# EAGLE schematic 1 Strain Gauge Board (EAGLE 9.1.3)
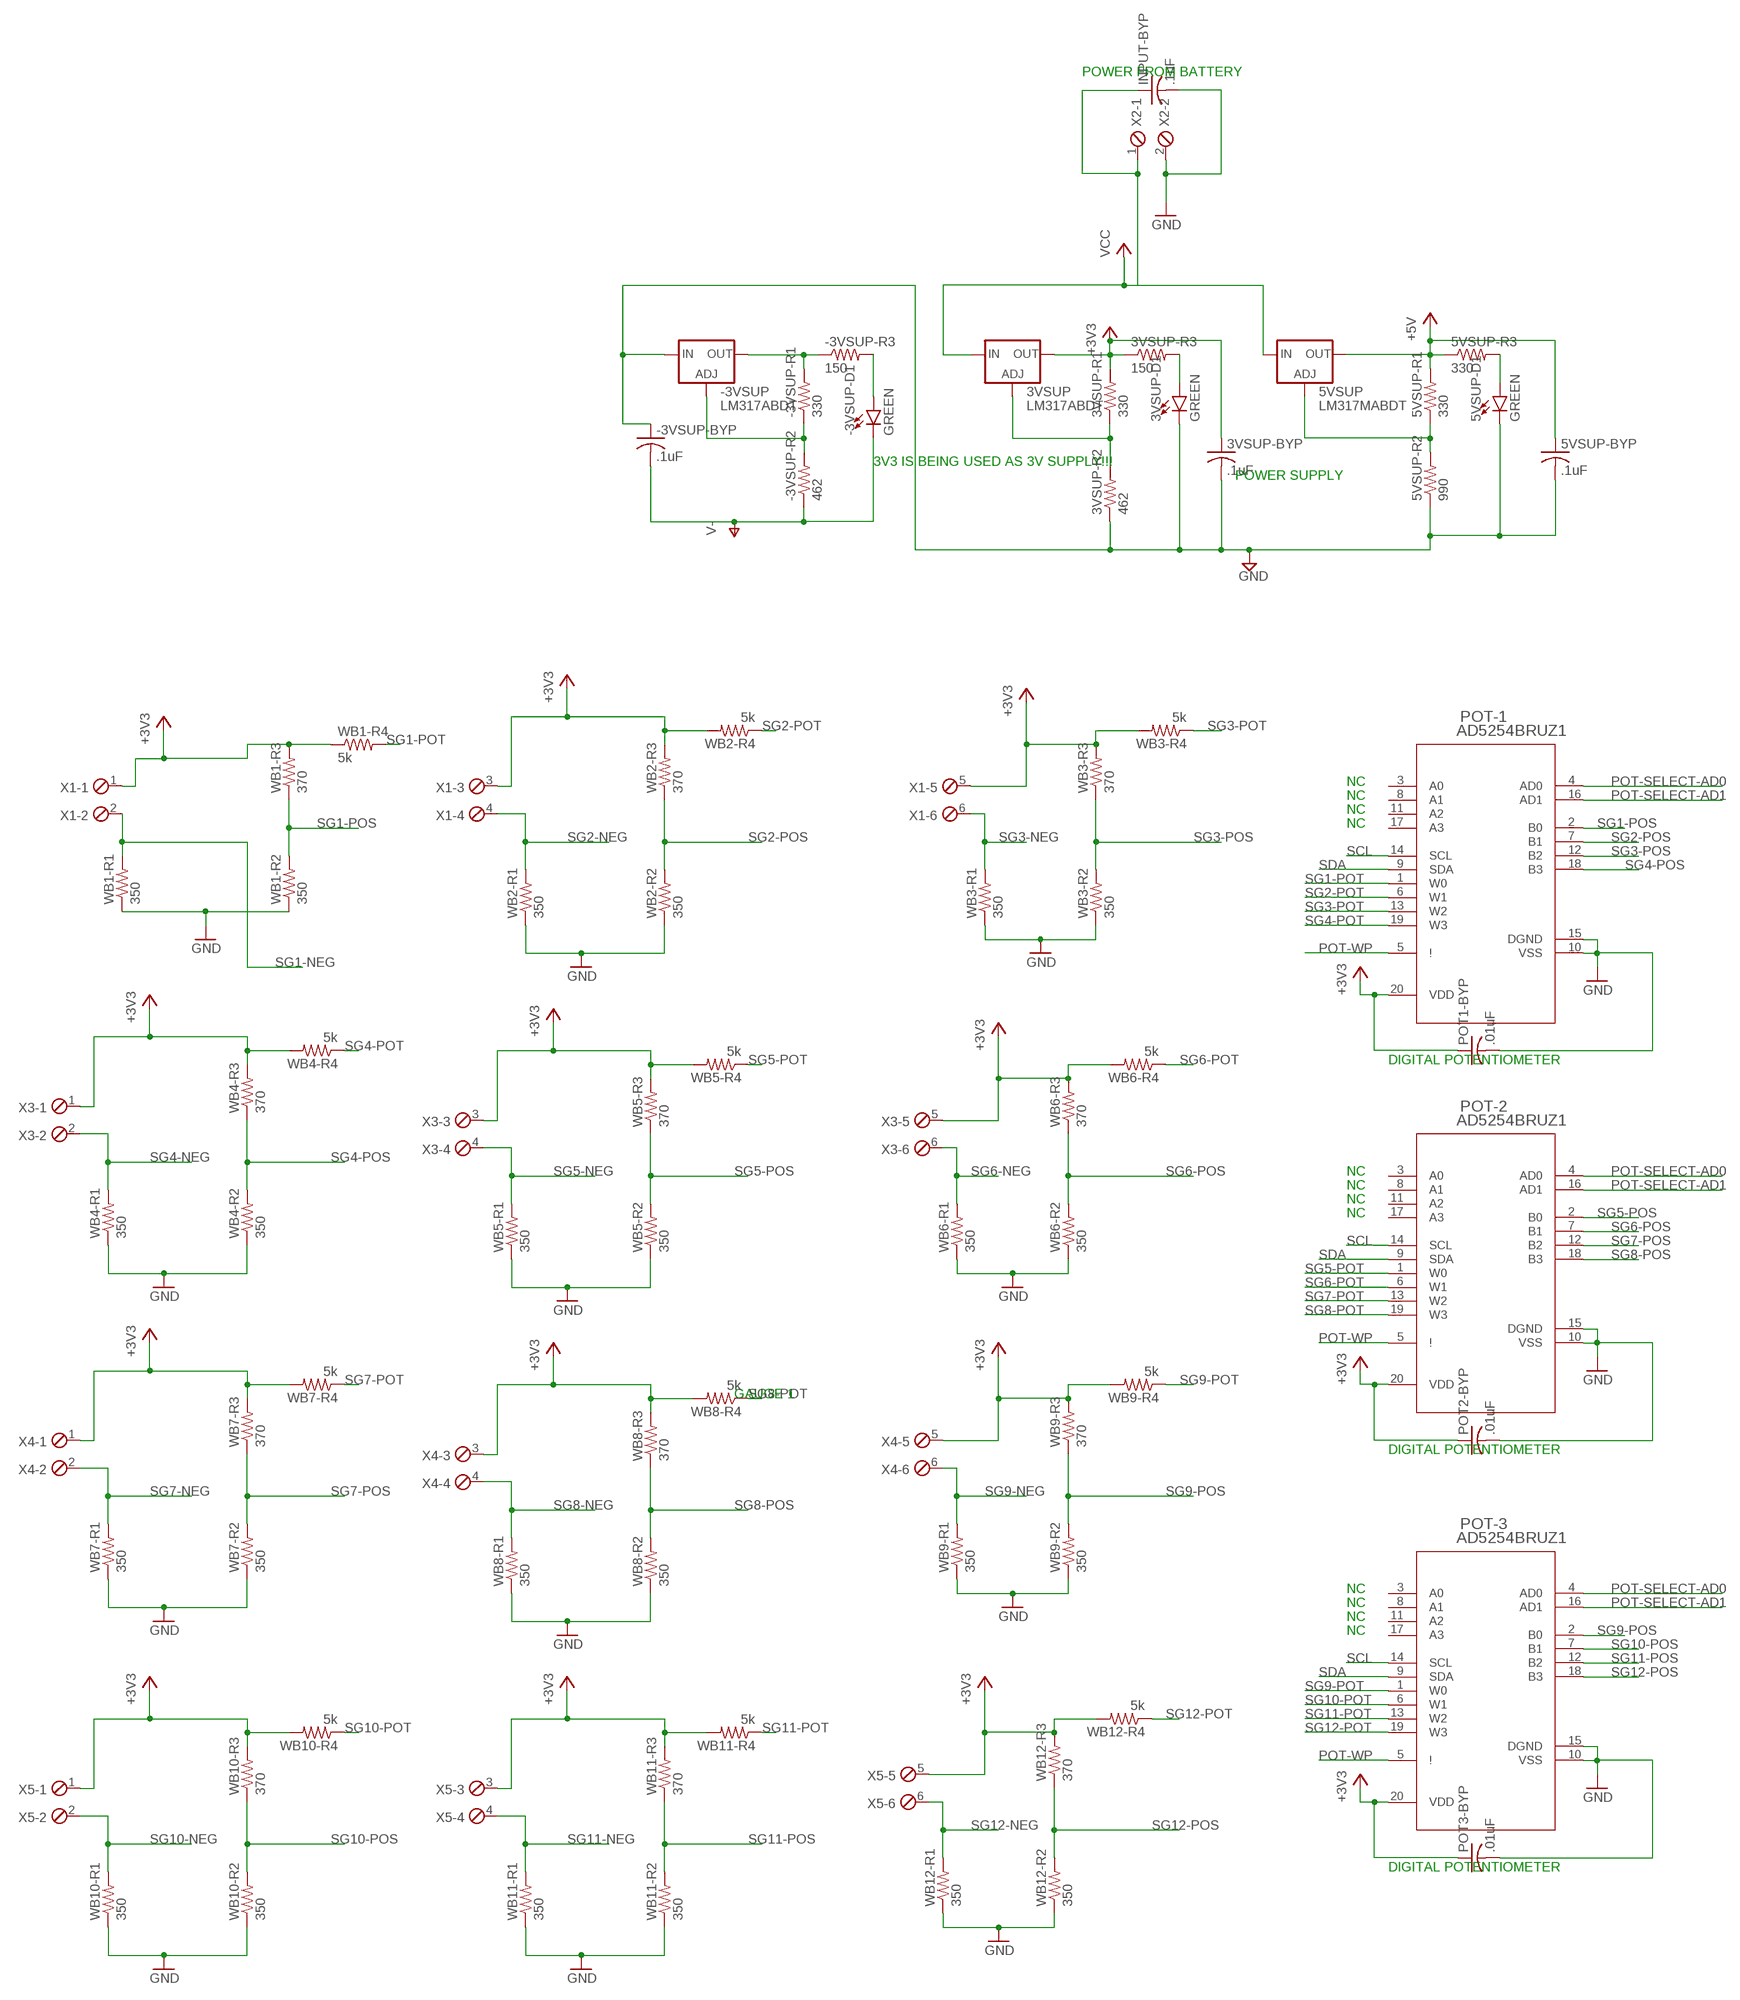
[diagram p0: schematic, sheet 1, part 1 of 3]
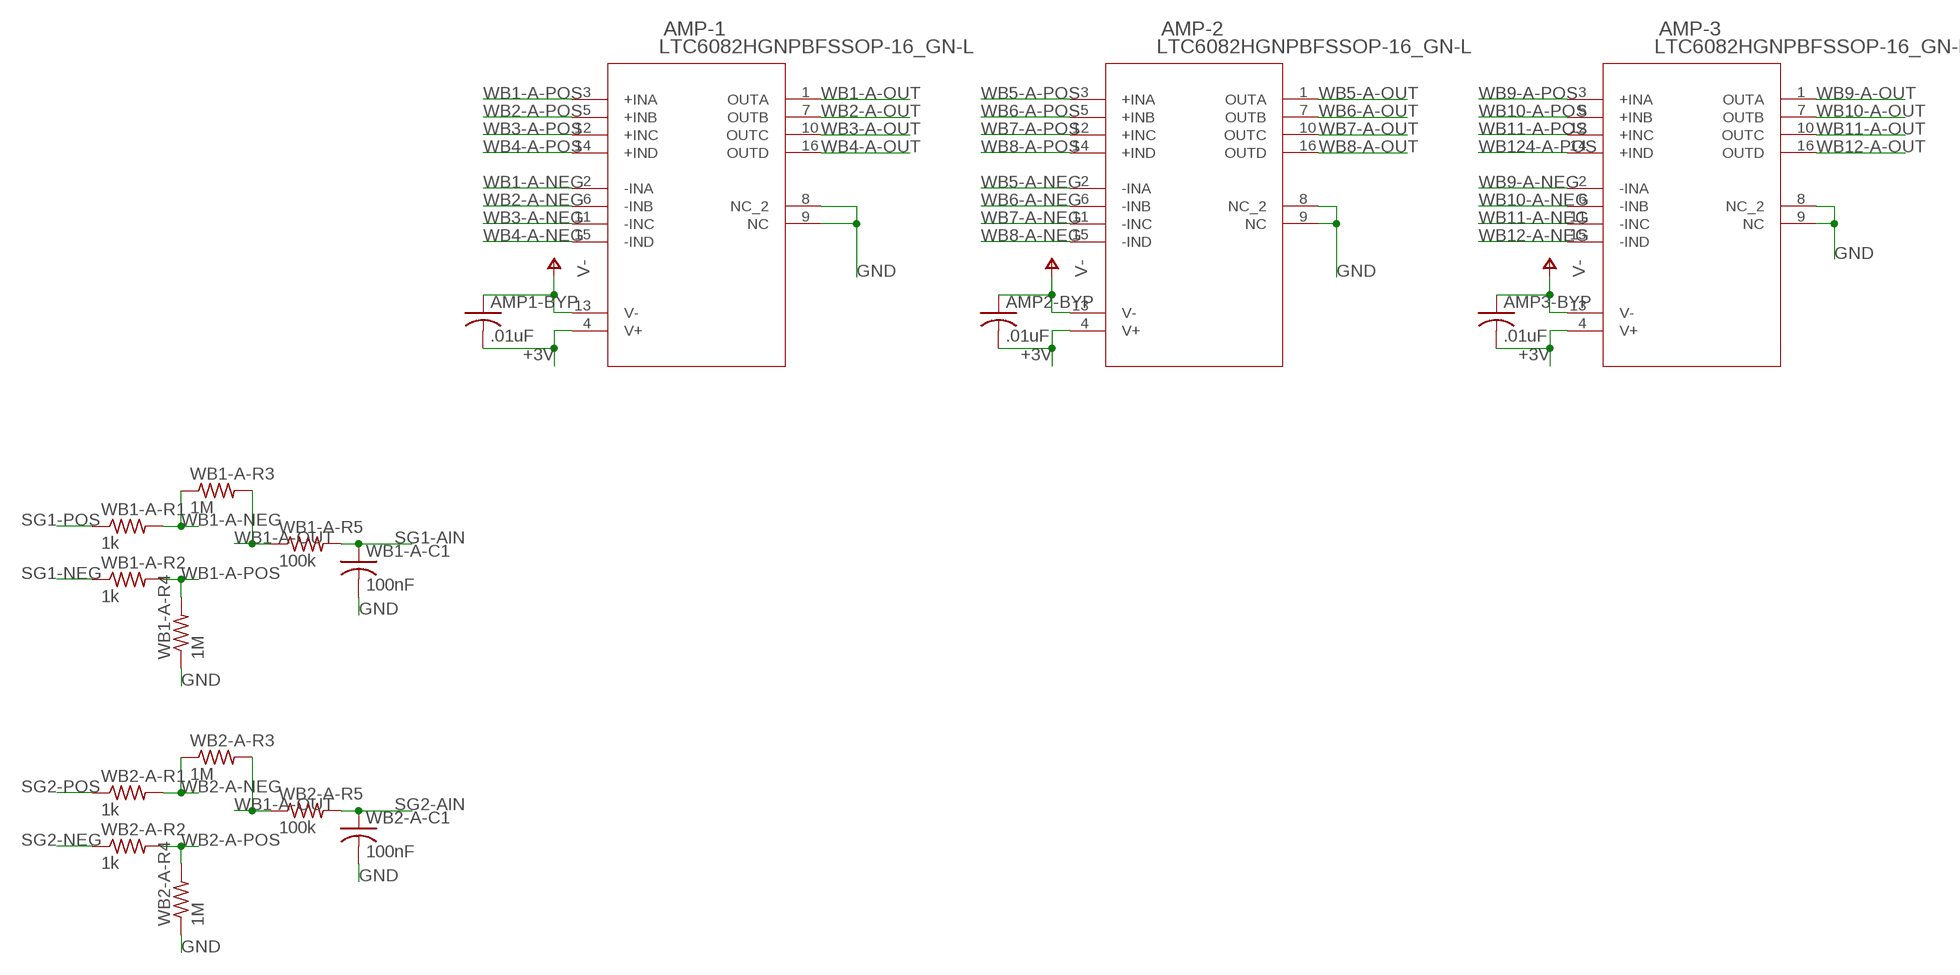
[diagram p1: schematic, sheet 1, part 2 of 3]
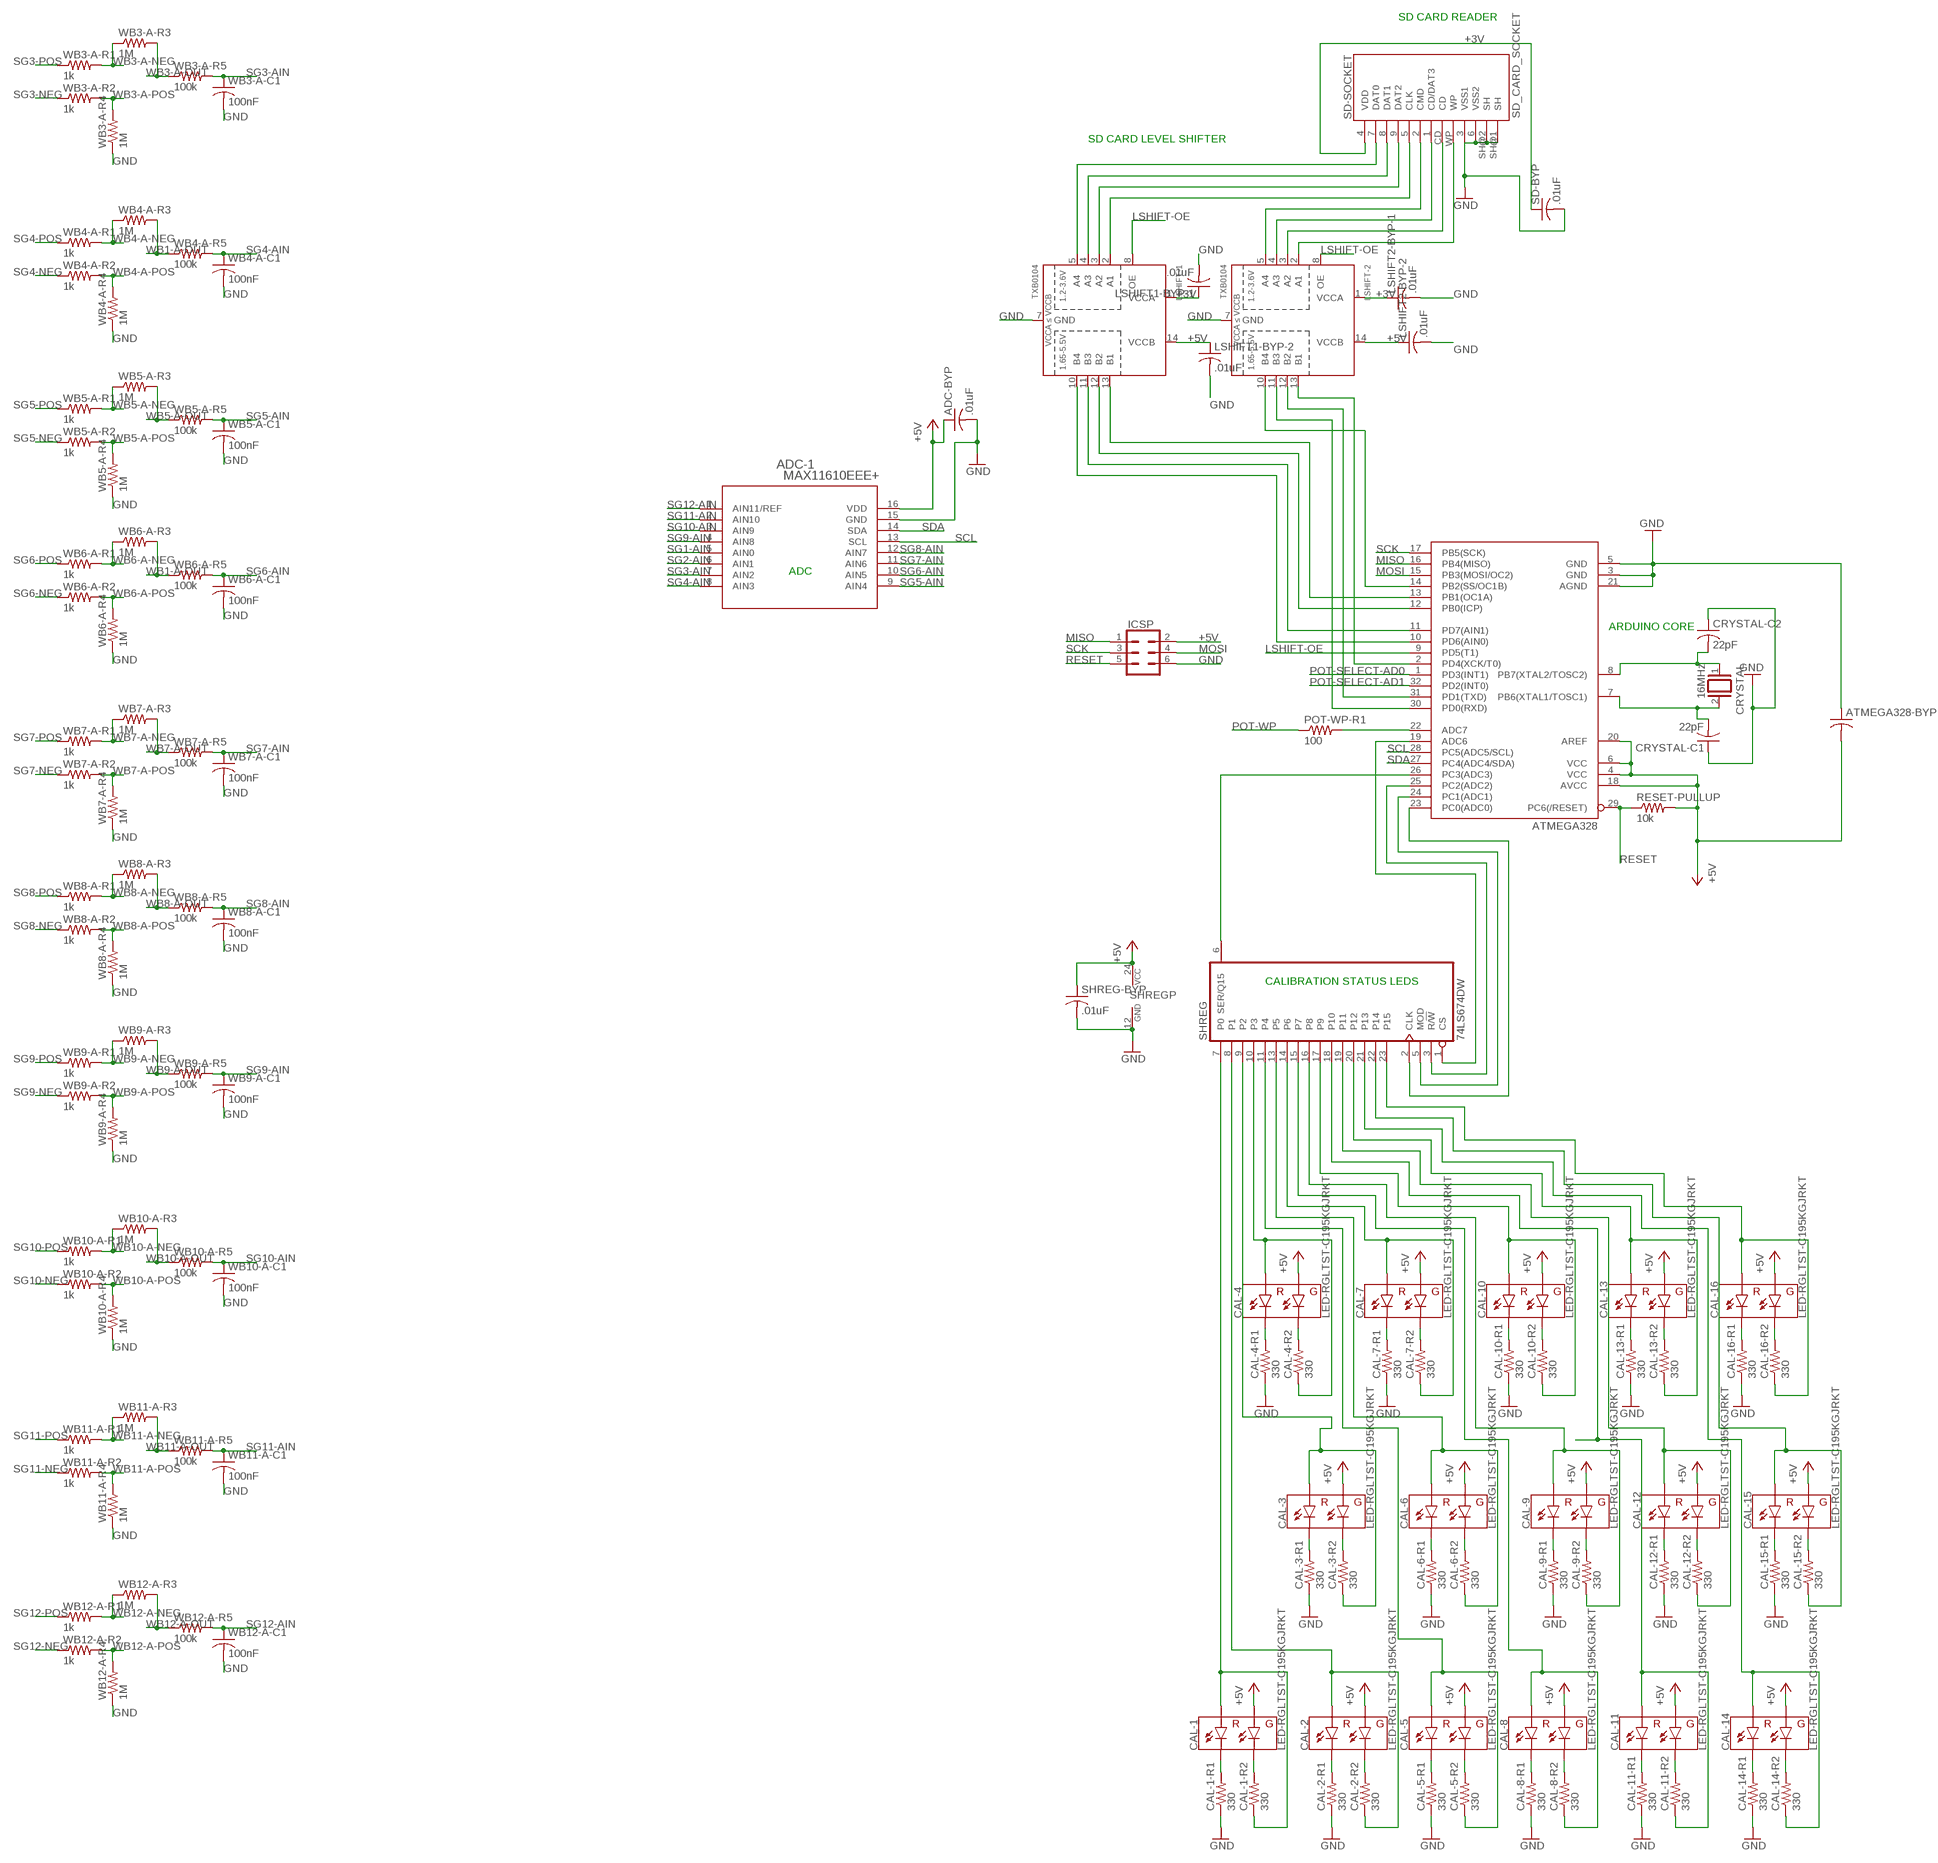
[diagram p2: schematic, sheet 1, part 3 of 3]

## Parts
3VSUP  LM317ABDT  LM317MABDT  [DPACK]
3VSUP-BYP  .1uF  C-USC1206K  [C1206K]
3VSUP-D1  GREEN  LED-GREEN1206  [LED-1206]
3VSUP-R1  330  R-US_M1206  [M1206]
3VSUP-R2  462  R-US_M1206  [M1206]
3VSUP-R3  150  R-US_M1206  [M1206]
5VSUP  LM317MABDT  [DPACK]
5VSUP-BYP  .1uF  C-USC1206K  [C1206K]
5VSUP-D1  GREEN  LED-GREEN1206  [LED-1206]
5VSUP-R1  330  R-US_M1206  [M1206]
5VSUP-R2  990  R-US_M1206  [M1206]
5VSUP-R3  330  R-US_M1206  [M1206]
-3VSUP  LM317ABDT  LM317MABDT  [DPACK]
-3VSUP-BYP  .1uF  C-USC1206K  [C1206K]
-3VSUP-D1  GREEN  LED-GREEN1206  [LED-1206]
-3VSUP-R1  330  R-US_M1206  [M1206]
-3VSUP-R2  462  R-US_M1206  [M1206]
-3VSUP-R3  150  R-US_M1206  [M1206]
ADC-1  MAX11610EEE+  [21-0055H_16]
ADC-BYP  .01uF  C-USC1206K  [C1206K]
AMP1-BYP  .01uF  C-USC1206K  [C1206K]
AMP2-BYP  .01uF  C-USC1206K  [C1206K]
AMP3-BYP  .01uF  C-USC1206K  [C1206K]
AMP-1  LTC6082HGNPBFSSOP-16_GN-L  [SSOP-16_GN-L]
AMP-2  LTC6082HGNPBFSSOP-16_GN-L  [SSOP-16_GN-L]
AMP-3  LTC6082HGNPBFSSOP-16_GN-L  [SSOP-16_GN-L]
ATMEGA328  ATMEGA328P_TQFP  [TQFP32-08]
ATMEGA328-BYP  C-USC1206  [C1206]
CAL-1  LED-RGLTST-C195KGJRKT  [LTST-C195KGJRKT]
CAL-1-R1  330  R-US_M1206  [M1206]
CAL-1-R2  330  R-US_M1206  [M1206]
CAL-2  LED-RGLTST-C195KGJRKT  [LTST-C195KGJRKT]
CAL-2-R1  330  R-US_M1206  [M1206]
CAL-2-R2  330  R-US_M1206  [M1206]
CAL-3  LED-RGLTST-C195KGJRKT  [LTST-C195KGJRKT]
CAL-3-R1  330  R-US_M1206  [M1206]
CAL-3-R2  330  R-US_M1206  [M1206]
CAL-4  LED-RGLTST-C195KGJRKT  [LTST-C195KGJRKT]
CAL-4-R1  330  R-US_M1206  [M1206]
CAL-4-R2  330  R-US_M1206  [M1206]
CAL-5  LED-RGLTST-C195KGJRKT  [LTST-C195KGJRKT]
CAL-5-R1  330  R-US_M1206  [M1206]
CAL-5-R2  330  R-US_M1206  [M1206]
CAL-6  LED-RGLTST-C195KGJRKT  [LTST-C195KGJRKT]
CAL-6-R1  330  R-US_M1206  [M1206]
CAL-6-R2  330  R-US_M1206  [M1206]
CAL-7  LED-RGLTST-C195KGJRKT  [LTST-C195KGJRKT]
CAL-7-R1  330  R-US_M1206  [M1206]
CAL-7-R2  330  R-US_M1206  [M1206]
CAL-8  LED-RGLTST-C195KGJRKT  [LTST-C195KGJRKT]
CAL-8-R1  330  R-US_M1206  [M1206]
CAL-8-R2  330  R-US_M1206  [M1206]
CAL-9  LED-RGLTST-C195KGJRKT  [LTST-C195KGJRKT]
CAL-9-R1  330  R-US_M1206  [M1206]
CAL-9-R2  330  R-US_M1206  [M1206]
CAL-10  LED-RGLTST-C195KGJRKT  [LTST-C195KGJRKT]
CAL-10-R1  330  R-US_M1206  [M1206]
CAL-10-R2  330  R-US_M1206  [M1206]
CAL-11  LED-RGLTST-C195KGJRKT  [LTST-C195KGJRKT]
CAL-11-R1  330  R-US_M1206  [M1206]
CAL-11-R2  330  R-US_M1206  [M1206]
CAL-12  LED-RGLTST-C195KGJRKT  [LTST-C195KGJRKT]
CAL-12-R1  330  R-US_M1206  [M1206]
CAL-12-R2  330  R-US_M1206  [M1206]
CAL-13  LED-RGLTST-C195KGJRKT  [LTST-C195KGJRKT]
CAL-13-R1  330  R-US_M1206  [M1206]
CAL-13-R2  330  R-US_M1206  [M1206]
CAL-14  LED-RGLTST-C195KGJRKT  [LTST-C195KGJRKT]
CAL-14-R1  330  R-US_M1206  [M1206]
CAL-14-R2  330  R-US_M1206  [M1206]
CAL-15  LED-RGLTST-C195KGJRKT  [LTST-C195KGJRKT]
CAL-15-R1  330  R-US_M1206  [M1206]
CAL-15-R2  330  R-US_M1206  [M1206]
CAL-16  LED-RGLTST-C195KGJRKT  [LTST-C195KGJRKT]
CAL-16-R1  330  R-US_M1206  [M1206]
CAL-16-R2  330  R-US_M1206  [M1206]
CRYSTAL  16MHz  XTAL/S  [QS]
CRYSTAL-C1  22pF  C-USC1206K  [C1206K]
CRYSTAL-C2  22pF  C-USC1206K  [C1206K]
ICSP  CONN_03X2FEMALE  [2X3]
INPUT-BYP  .1uF  C-USC1206K  [C1206K]
LSHIFT1-BYP-1  .01uF  C-USC1206K  [C1206K]
LSHIFT1-BYP-2  .01uF  C-USC1206K  [C1206K]
LSHIFT2-BYP-1  .01uF  C-USC1206K  [C1206K]
LSHIFT2-BYP-2  .01uF  C-USC1206K  [C1206K]
LSHIFT-1  TXB0104  TXB0104PWRSOIC14  [SO14]
LSHIFT-2  TXB0104  TXB0104PWRSOIC14  [SO14]
POT1-BYP  .01uF  C-USC1206K  [C1206K]
POT2-BYP  .01uF  C-USC1206K  [C1206K]
POT3-BYP  .01uF  C-USC1206K  [C1206K]
POT-1  AD5254BRUZ1  [RU_20]
POT-2  AD5254BRUZ1  [RU_20]
POT-3  AD5254BRUZ1  [RU_20]
POT-WP-R1  100  R-US_M1206  [M1206]
RESET-PULLUP  10k  R-US_M1206  [M1206]
SD-BYP  .01uF  C-USC1206K  [C1206K]
SD-SOCKET  SD_CARD_SOCKET  [SD]
SHREG  74LS674DW  [SO24W]
SHREG-BYP  .01uF  C-USC1206K  [C1206K]
WB1-A-C1  100nF  C-USC1206K  [C1206K]
WB1-A-R1  1k  R-US_M1206  [M1206]
WB1-A-R2  1k  R-US_M1206  [M1206]
WB1-A-R3  1M  R-US_M1206  [M1206]
WB1-A-R4  1M  R-US_M1206  [M1206]
WB1-A-R5  100k  R-US_M1206  [M1206]
WB1-R1  350  R-US_M1206  [M1206]
WB1-R2  350  R-US_M1206  [M1206]
WB1-R3  370  R-US_M1206  [M1206]
WB1-R4  5k  R-US_M1206  [M1206]
WB2-A-C1  100nF  C-USC1206K  [C1206K]
WB2-A-R1  1k  R-US_M1206  [M1206]
WB2-A-R2  1k  R-US_M1206  [M1206]
WB2-A-R3  1M  R-US_M1206  [M1206]
WB2-A-R4  1M  R-US_M1206  [M1206]
WB2-A-R5  100k  R-US_M1206  [M1206]
WB2-R1  350  R-US_M1206  [M1206]
WB2-R2  350  R-US_M1206  [M1206]
WB2-R3  370  R-US_M1206  [M1206]
WB2-R4  5k  R-US_M1206  [M1206]
WB3-A-C1  100nF  C-USC1206K  [C1206K]
WB3-A-R1  1k  R-US_M1206  [M1206]
WB3-A-R2  1k  R-US_M1206  [M1206]
WB3-A-R3  1M  R-US_M1206  [M1206]
WB3-A-R4  1M  R-US_M1206  [M1206]
WB3-A-R5  100k  R-US_M1206  [M1206]
WB3-R1  350  R-US_M1206  [M1206]
WB3-R2  350  R-US_M1206  [M1206]
WB3-R3  370  R-US_M1206  [M1206]
WB3-R4  5k  R-US_M1206  [M1206]
WB4-A-C1  100nF  C-USC1206K  [C1206K]
WB4-A-R1  1k  R-US_M1206  [M1206]
WB4-A-R2  1k  R-US_M1206  [M1206]
WB4-A-R3  1M  R-US_M1206  [M1206]
WB4-A-R4  1M  R-US_M1206  [M1206]
WB4-A-R5  100k  R-US_M1206  [M1206]
WB4-R1  350  R-US_M1206  [M1206]
WB4-R2  350  R-US_M1206  [M1206]
WB4-R3  370  R-US_M1206  [M1206]
WB4-R4  5k  R-US_M1206  [M1206]
WB5-A-C1  100nF  C-USC1206K  [C1206K]
WB5-A-R1  1k  R-US_M1206  [M1206]
WB5-A-R2  1k  R-US_M1206  [M1206]
WB5-A-R3  1M  R-US_M1206  [M1206]
WB5-A-R4  1M  R-US_M1206  [M1206]
WB5-A-R5  100k  R-US_M1206  [M1206]
WB5-R1  350  R-US_M1206  [M1206]
WB5-R2  350  R-US_M1206  [M1206]
WB5-R3  370  R-US_M1206  [M1206]
WB5-R4  5k  R-US_M1206  [M1206]
WB6-A-C1  100nF  C-USC1206K  [C1206K]
WB6-A-R1  1k  R-US_M1206  [M1206]
WB6-A-R2  1k  R-US_M1206  [M1206]
WB6-A-R3  1M  R-US_M1206  [M1206]
WB6-A-R4  1M  R-US_M1206  [M1206]
WB6-A-R5  100k  R-US_M1206  [M1206]
WB6-R1  350  R-US_M1206  [M1206]
WB6-R2  350  R-US_M1206  [M1206]
WB6-R3  370  R-US_M1206  [M1206]
WB6-R4  5k  R-US_M1206  [M1206]
WB7-A-C1  100nF  C-USC1206K  [C1206K]
WB7-A-R1  1k  R-US_M1206  [M1206]
WB7-A-R2  1k  R-US_M1206  [M1206]
WB7-A-R3  1M  R-US_M1206  [M1206]
WB7-A-R4  1M  R-US_M1206  [M1206]
WB7-A-R5  100k  R-US_M1206  [M1206]
WB7-R1  350  R-US_M1206  [M1206]
WB7-R2  350  R-US_M1206  [M1206]
WB7-R3  370  R-US_M1206  [M1206]
WB7-R4  5k  R-US_M1206  [M1206]
WB8-A-C1  100nF  C-USC1206K  [C1206K]
WB8-A-R1  1k  R-US_M1206  [M1206]
WB8-A-R2  1k  R-US_M1206  [M1206]
WB8-A-R3  1M  R-US_M1206  [M1206]
WB8-A-R4  1M  R-US_M1206  [M1206]
WB8-A-R5  100k  R-US_M1206  [M1206]
WB8-R1  350  R-US_M1206  [M1206]
WB8-R2  350  R-US_M1206  [M1206]
WB8-R3  370  R-US_M1206  [M1206]
WB8-R4  5k  R-US_M1206  [M1206]
WB9-A-C1  100nF  C-USC1206K  [C1206K]
WB9-A-R1  1k  R-US_M1206  [M1206]
WB9-A-R2  1k  R-US_M1206  [M1206]
WB9-A-R3  1M  R-US_M1206  [M1206]
WB9-A-R4  1M  R-US_M1206  [M1206]
WB9-A-R5  100k  R-US_M1206  [M1206]
WB9-R1  350  R-US_M1206  [M1206]
WB9-R2  350  R-US_M1206  [M1206]
WB9-R3  370  R-US_M1206  [M1206]
WB9-R4  5k  R-US_M1206  [M1206]
WB10-A-C1  100nF  C-USC1206K  [C1206K]
WB10-A-R1  1k  R-US_M1206  [M1206]
WB10-A-R2  1k  R-US_M1206  [M1206]
WB10-A-R3  1M  R-US_M1206  [M1206]
WB10-A-R4  1M  R-US_M1206  [M1206]
WB10-A-R5  100k  R-US_M1206  [M1206]
WB10-R1  350  R-US_M1206  [M1206]
WB10-R2  350  R-US_M1206  [M1206]
WB10-R3  370  R-US_M1206  [M1206]
WB10-R4  5k  R-US_M1206  [M1206]
WB11-A-C1  100nF  C-USC1206K  [C1206K]
WB11-A-R1  1k  R-US_M1206  [M1206]
WB11-A-R2  1k  R-US_M1206  [M1206]
WB11-A-R3  1M  R-US_M1206  [M1206]
WB11-A-R4  1M  R-US_M1206  [M1206]
WB11-A-R5  100k  R-US_M1206  [M1206]
WB11-R1  350  R-US_M1206  [M1206]
WB11-R2  350  R-US_M1206  [M1206]
WB11-R3  370  R-US_M1206  [M1206]
WB11-R4  5k  R-US_M1206  [M1206]
WB12-A-C1  100nF  C-USC1206K  [C1206K]
WB12-A-R1  1k  R-US_M1206  [M1206]
WB12-A-R2  1k  R-US_M1206  [M1206]
WB12-A-R3  1M  R-US_M1206  [M1206]
WB12-A-R4  1M  R-US_M1206  [M1206]
WB12-A-R5  100k  R-US_M1206  [M1206]
WB12-R1  350  R-US_M1206  [M1206]
WB12-R2  350  R-US_M1206  [M1206]
WB12-R3  370  R-US_M1206  [M1206]
WB12-R4  5k  R-US_M1206  [M1206]
X1  MPT6  [6POL254]
X2  MPT2  [2POL254]
X3  MPT6  [6POL254]
X4  MPT6  [6POL254]
X5  MPT6  [6POL254]

## Nets
+3V: 3VSUP-BYP.1 3VSUP-R1.2 3VSUP-R3.1 3VSUP.4(OUT) AMP1-BYP.2 AMP2-BYP.2 AMP3-BYP.2 AMP-1.4(V+) AMP-2.4(V+) AMP-3.4(V+) LSHIFT1-BYP-1.1 LSHIFT2-BYP-1.1 LSHIFT-1.1(VCCA) LSHIFT-2.1(VCCA) POT1-BYP.1 POT2-BYP.1 POT3-BYP.1 POT-1.20(VDD) POT-2.20(VDD) POT-3.20(VDD) SD-BYP.1 SD-SOCKET.4(VDD) WB1-R3.2 WB1-R4.1 WB2-R3.2 WB2-R4.2 WB3-R3.2 WB3-R4.2 WB4-R3.2 WB4-R4.2 WB5-R3.2 WB5-R4.2 WB6-R3.2 WB6-R4.2 WB7-R3.2 WB7-R4.2 WB8-R3.2 WB8-R4.2 WB9-R3.2 WB9-R4.2 WB10-R3.2 WB10-R4.2 WB11-R3.2 WB11-R4.2 WB12-R3.2 WB12-R4.2 X1.1 X1.3 X1.5 X3.1 X3.3 X3.5 X4.1 X4.3 X4.5 X5.1 X5.3 X5.5 ; supply symbol labelled +3V3
+5V: 5VSUP-BYP.1 5VSUP-R1.2 5VSUP-R3.1 5VSUP.4(OUT) ADC-1.16(VDD) ADC-BYP.1 ATMEGA328-BYP.2 ATMEGA328.4(VCC) ATMEGA328.6(VCC) ATMEGA328.18(AVCC) ATMEGA328.20(AREF) CAL-1.P$1(GA) CAL-2.P$1(GA) CAL-3.P$1(GA) CAL-4.P$1(GA) CAL-5.P$1(GA) CAL-6.P$1(GA) CAL-7.P$1(GA) CAL-8.P$1(GA) CAL-9.P$1(GA) CAL-10.P$1(GA) CAL-11.P$1(GA) CAL-12.P$1(GA) CAL-13.P$1(GA) CAL-14.P$1(GA) CAL-15.P$1(GA) CAL-16.P$1(GA) ICSP.2 LSHIFT1-BYP-2.1 LSHIFT2-BYP-2.1 LSHIFT-1.14(VCCB) LSHIFT-2.14(VCCB) RESET-PULLUP.2 SHREG-BYP.1 SHREG.24(VCC)
-3V: -3VSUP-R1.2 -3VSUP-R3.1 -3VSUP.4(OUT)
GND: 3VSUP-BYP.2 3VSUP-D1.C 3VSUP-R2.1 5VSUP-BYP.2 5VSUP-D1.C 5VSUP-R2.1 -3VSUP-BYP.1 -3VSUP.3(IN) ADC-1.15(GND) ADC-BYP.2 AMP-1.8(NC_2) AMP-1.9(NC) AMP-2.8(NC_2) AMP-2.9(NC) AMP-3.8(NC_2) AMP-3.9(NC) ATMEGA328-BYP.1 ATMEGA328.3(GND) ATMEGA328.5(GND) ATMEGA328.21(AGND) CAL-1-R1.1 CAL-2-R1.1 CAL-3-R1.1 CAL-4-R1.1 CAL-5-R1.1 CAL-6-R1.1 CAL-7-R1.1 CAL-8-R1.1 CAL-9-R1.1 CAL-10-R1.1 CAL-11-R1.1 CAL-12-R1.1 CAL-13-R1.1 CAL-14-R1.1 CAL-15-R1.1 CAL-16-R1.1 CRYSTAL-C1.1 CRYSTAL-C2.1 ICSP.6 INPUT-BYP.2 LSHIFT1-BYP-1.2 LSHIFT1-BYP-2.2 LSHIFT2-BYP-1.2 LSHIFT2-BYP-2.2 LSHIFT-1.7(GND) LSHIFT-2.7(GND) POT1-BYP.2 POT2-BYP.2 POT3-BYP.2 POT-1.10(VSS) POT-1.15(DGND) POT-2.10(VSS) POT-2.15(DGND) POT-3.10(VSS) POT-3.15(DGND) SD-BYP.2 SD-SOCKET.3(VSS1) SD-SOCKET.6(VSS2) SD-SOCKET.SH@1(SH) SD-SOCKET.SH@2(SH) SHREG-BYP.2 SHREG.12(GND) WB1-A-C1.2 WB1-A-R4.1 WB1-R1.1 WB1-R2.1 WB2-A-C1.2 WB2-A-R4.1 WB2-R1.1 WB2-R2.1 WB3-A-C1.2 WB3-A-R4.1 WB3-R1.1 WB3-R2.1 WB4-A-C1.2 WB4-A-R4.1 WB4-R1.1 WB4-R2.1 WB5-A-C1.2 WB5-A-R4.1 WB5-R1.1 WB5-R2.1 WB6-A-C1.2 WB6-A-R4.1 WB6-R1.1 WB6-R2.1 WB7-A-C1.2 WB7-A-R4.1 WB7-R1.1 WB7-R2.1 WB8-A-C1.2 WB8-A-R4.1 WB8-R1.1 WB8-R2.1 WB9-A-C1.2 WB9-A-R4.1 WB9-R1.1 WB9-R2.1 WB10-A-C1.2 WB10-A-R4.1 WB10-R1.1 WB10-R2.1 WB11-A-C1.2 WB11-A-R4.1 WB11-R1.1 WB11-R2.1 WB12-A-C1.2 WB12-A-R4.1 WB12-R1.1 WB12-R2.1 X2.2
LSHIFT-OE: ATMEGA328.9(PD5(T1)) LSHIFT-1.8(OE) LSHIFT-2.8(OE)
MISO: ATMEGA328.16(PB4(MISO)) ICSP.1
MOSI: ATMEGA328.15(PB3(MOSI/OC2)) ICSP.4
N$1: -3VSUP-D1.A -3VSUP-R3.2
N$2: -3VSUP-R1.1 -3VSUP-R2.2 -3VSUP.1(ADJ)
N$5: ATMEGA328.22(ADC7) POT-WP-R1.2
N$12: 3VSUP-R1.1 3VSUP-R2.2 3VSUP.1(ADJ)
N$13: LSHIFT-2.4(A3) SD-SOCKET.1(CD/DAT3)
N$14: 5VSUP-R1.1 5VSUP-R2.2 5VSUP.1(ADJ)
N$15: LSHIFT-2.2(A1) SD-SOCKET.WP
N$17: LSHIFT-2.3(A2) SD-SOCKET.CD
N$18: LSHIFT-2.5(A4) SD-SOCKET.2(CMD)
N$19: ATMEGA328.7(PB6(XTAL1/TOSC1)) CRYSTAL-C1.2 CRYSTAL.2
N$20: ATMEGA328.8(PB7(XTAL2/TOSC2)) CRYSTAL-C2.2 CRYSTAL.1
N$21: LSHIFT-1.2(A1) SD-SOCKET.5(CLK)
N$22: LSHIFT-1.3(A2) SD-SOCKET.9(DAT2)
N$23: LSHIFT-1.4(A3) SD-SOCKET.8(DAT1)
N$24: LSHIFT-1.5(A4) SD-SOCKET.7(DAT0)
N$25: CAL-1-R1.2 CAL-1.P$4(RC)
N$26: CAL-1-R2.2 CAL-1.P$3(GC)
N$27: CAL-1-R2.1 CAL-1.P$2(RA) SHREG.7(P0)
N$28: ATMEGA328.2(PD4(XCK/T0)) LSHIFT-2.13(B1)
N$29: ATMEGA328.31(PD1(TXD)) LSHIFT-2.12(B2)
N$30: ATMEGA328.30(PD0(RXD)) LSHIFT-2.11(B3)
N$31: ATMEGA328.14(PB2(SS/OC1B)) LSHIFT-2.10(B4)
N$32: ATMEGA328.13(PB1(OC1A)) LSHIFT-1.13(B1)
N$33: ATMEGA328.12(PB0(ICP)) LSHIFT-1.12(B2)
N$34: ATMEGA328.11(PD7(AIN1)) LSHIFT-1.11(B3)
N$35: ATMEGA328.10(PD6(AIN0)) LSHIFT-1.10(B4)
N$36: ATMEGA328.26(PC3(ADC3)) SHREG.6(SER/Q15)
N$37: ATMEGA328.23(PC0(ADC0)) SHREG.2(CLK)
N$38: ATMEGA328.24(PC1(ADC1)) SHREG.5(MOD)
N$39: ATMEGA328.25(PC2(ADC2)) SHREG.3(R/!W)
N$40: ATMEGA328.19(ADC6) SHREG.1(CS)
N$41: CAL-2-R1.2 CAL-2.P$4(RC)
N$42: CAL-2-R2.2 CAL-2.P$3(GC)
N$43: 3VSUP-D1.A 3VSUP-R3.2
N$44: 5VSUP-D1.A 5VSUP-R3.2
N$45: CAL-2-R2.1 CAL-2.P$2(RA) SHREG.8(P1)
N$46: CAL-5-R1.2 CAL-5.P$4(RC)
N$47: CAL-5-R2.2 CAL-5.P$3(GC)
N$48: CAL-5-R2.1 CAL-5.P$2(RA) SHREG.11(P4)
N$49: CAL-8-R1.2 CAL-8.P$4(RC)
N$50: CAL-8-R2.2 CAL-8.P$3(GC)
N$51: CAL-8-R2.1 CAL-8.P$2(RA) SHREG.15(P7)
N$52: CAL-6-R1.2 CAL-6.P$4(RC)
N$53: CAL-6-R2.2 CAL-6.P$3(GC)
N$54: CAL-6-R2.1 CAL-6.P$2(RA) SHREG.13(P5)
N$55: CAL-3-R1.2 CAL-3.P$4(RC)
N$56: CAL-3-R2.2 CAL-3.P$3(GC)
N$57: CAL-3-R2.1 CAL-3.P$2(RA) SHREG.9(P2)
N$58: CAL-9-R1.2 CAL-9.P$4(RC)
N$59: CAL-9-R2.2 CAL-9.P$3(GC)
N$60: CAL-9-R2.1 CAL-9.P$2(RA) SHREG.16(P8)
N$61: CAL-11-R1.2 CAL-11.P$4(RC)
N$62: CAL-11-R2.2 CAL-11.P$3(GC)
N$63: CAL-11-R2.1 CAL-11.P$2(RA) SHREG.18(P10)
N$64: CAL-12-R1.2 CAL-12.P$4(RC)
N$65: CAL-12-R2.2 CAL-12.P$3(GC)
N$66: CAL-12-R2.1 CAL-12.P$2(RA) SHREG.19(P11)
N$67: CAL-14-R1.2 CAL-14.P$4(RC)
N$68: CAL-14-R2.2 CAL-14.P$3(GC)
N$69: CAL-14-R2.1 CAL-14.P$2(RA) SHREG.21(P13)
N$70: CAL-15-R1.2 CAL-15.P$4(RC)
N$71: CAL-15-R2.2 CAL-15.P$3(GC)
N$72: CAL-15-R2.1 CAL-15.P$2(RA) SHREG.22(P14)
N$73: CAL-7-R1.2 CAL-7.P$4(RC)
N$74: CAL-7-R2.2 CAL-7.P$3(GC)
N$75: CAL-7-R2.1 CAL-7.P$2(RA) SHREG.14(P6)
N$76: CAL-10-R1.2 CAL-10.P$4(RC)
N$77: CAL-10-R2.2 CAL-10.P$3(GC)
N$78: CAL-10-R2.1 CAL-10.P$2(RA) SHREG.17(P9)
N$79: CAL-13-R1.2 CAL-13.P$4(RC)
N$80: CAL-13-R2.2 CAL-13.P$3(GC)
N$81: CAL-13-R2.1 CAL-13.P$2(RA) SHREG.20(P12)
N$82: CAL-16-R1.2 CAL-16.P$4(RC)
N$83: CAL-16-R2.2 CAL-16.P$3(GC)
N$84: CAL-16-R2.1 CAL-16.P$2(RA) SHREG.23(P15)
N$85: CAL-4-R1.2 CAL-4.P$4(RC)
N$86: CAL-4-R2.2 CAL-4.P$3(GC)
N$87: CAL-4-R2.1 CAL-4.P$2(RA) SHREG.10(P3)
POT-SELECT-AD0: ATMEGA328.1(PD3(INT1)) POT-1.4(AD0) POT-2.4(AD0) POT-3.4(AD0)
POT-SELECT-AD1: ATMEGA328.32(PD2(INT0)) POT-1.16(AD1) POT-2.16(AD1) POT-3.16(AD1)
POT-WP: POT-1.5(!) POT-2.5(!) POT-3.5(!) POT-WP-R1.1
RESET: ATMEGA328.29(PC6(/RESET)) ICSP.5 RESET-PULLUP.1
SCK: ATMEGA328.17(PB5(SCK)) ICSP.3
SCL: ADC-1.13(SCL) ATMEGA328.28(PC5(ADC5/SCL)) POT-1.14(SCL) POT-2.14(SCL) POT-3.14(SCL)
SDA: ADC-1.14(SDA) ATMEGA328.27(PC4(ADC4/SDA)) POT-1.9(SDA) POT-2.9(SDA) POT-3.9(SDA)
SG1-AIN: ADC-1.5(AIN0) WB1-A-C1.1 WB1-A-R5.2
SG1-NEG: WB1-A-R2.1 WB1-R1.2 X1.2
SG1-POS: POT-1.2(B0) WB1-A-R1.1 WB1-R2.2 WB1-R3.1
SG1-POT: POT-1.1(W0) WB1-R4.2
SG2-AIN: ADC-1.6(AIN1) WB2-A-C1.1 WB2-A-R5.2
SG2-NEG: WB2-A-R2.1 WB2-R1.2 X1.4
SG2-POS: POT-1.7(B1) WB2-A-R1.1 WB2-R2.2 WB2-R3.1
SG2-POT: POT-1.6(W1) WB2-R4.1
SG3-AIN: ADC-1.7(AIN2) WB3-A-C1.1 WB3-A-R5.2
SG3-NEG: WB3-A-R2.1 WB3-R1.2 X1.6
SG3-POS: POT-1.12(B2) WB3-A-R1.1 WB3-R2.2 WB3-R3.1
SG3-POT: POT-1.13(W2) WB3-R4.1
SG4-AIN: ADC-1.8(AIN3) WB4-A-C1.1 WB4-A-R5.2
SG4-NEG: WB4-A-R2.1 WB4-R1.2 X3.2
SG4-POS: POT-1.18(B3) WB4-A-R1.1 WB4-R2.2 WB4-R3.1
SG4-POT: POT-1.19(W3) WB4-R4.1
SG5-AIN: ADC-1.9(AIN4) WB5-A-C1.1 WB5-A-R5.2
SG5-NEG: WB5-A-R2.1 WB5-R1.2 X3.4
SG5-POS: POT-2.2(B0) WB5-A-R1.1 WB5-R2.2 WB5-R3.1
SG5-POT: POT-2.1(W0) WB5-R4.1
SG6-AIN: ADC-1.10(AIN5) WB6-A-C1.1 WB6-A-R5.2
SG6-NEG: WB6-A-R2.1 WB6-R1.2 X3.6
SG6-POS: POT-2.7(B1) WB6-A-R1.1 WB6-R2.2 WB6-R3.1
SG6-POT: POT-2.6(W1) WB6-R4.1
SG7-AIN: ADC-1.11(AIN6) WB7-A-C1.1 WB7-A-R5.2
SG7-NEG: WB7-A-R2.1 WB7-R1.2 X4.2
SG7-POS: POT-2.12(B2) WB7-A-R1.1 WB7-R2.2 WB7-R3.1
SG7-POT: POT-2.13(W2) WB7-R4.1
SG8-AIN: ADC-1.12(AIN7) WB8-A-C1.1 WB8-A-R5.2
SG8-NEG: WB8-A-R2.1 WB8-R1.2 X4.4
SG8-POS: POT-2.18(B3) WB8-A-R1.1 WB8-R2.2 WB8-R3.1
SG8-POT: POT-2.19(W3) WB8-R4.1
SG9-AIN: ADC-1.4(AIN8) WB9-A-C1.1 WB9-A-R5.2
SG9-NEG: WB9-A-R2.1 WB9-R1.2 X4.6
SG9-POS: POT-3.2(B0) WB9-A-R1.1 WB9-R2.2 WB9-R3.1
SG9-POT: POT-3.1(W0) WB9-R4.1
SG10-AIN: ADC-1.3(AIN9) WB10-A-C1.1 WB10-A-R5.2
SG10-NEG: WB10-A-R2.1 WB10-R1.2 X5.2
SG10-POS: POT-3.7(B1) WB10-A-R1.1 WB10-R2.2 WB10-R3.1
SG10-POT: POT-3.6(W1) WB10-R4.1
SG11-AIN: ADC-1.2(AIN10) WB11-A-C1.1 WB11-A-R5.2
SG11-NEG: WB11-A-R2.1 WB11-R1.2 X5.4
SG11-POS: POT-3.12(B2) WB11-A-R1.1 WB11-R2.2 WB11-R3.1
SG11-POT: POT-3.13(W2) WB11-R4.1
SG12-AIN: ADC-1.1(AIN11/REF) WB12-A-C1.1 WB12-A-R5.2
SG12-NEG: WB12-A-R2.1 WB12-R1.2 X5.6
SG12-POS: POT-3.18(B3) WB12-A-R1.1 WB12-R2.2 WB12-R3.1
SG12-POT: POT-3.19(W3) WB12-R4.1
V-: -3VSUP-BYP.2 -3VSUP-D1.C -3VSUP-R2.1 AMP1-BYP.1 AMP2-BYP.1 AMP3-BYP.1 AMP-1.13(V-) AMP-2.13(V-) AMP-3.13(V-)
VCC: 3VSUP.3(IN) 5VSUP.3(IN) INPUT-BYP.1 X2.1
WB1-A-NEG: AMP-1.2(-INA) WB1-A-R1.2 WB1-A-R3.1
WB1-A-OUT: AMP-1.1(OUTA) WB1-A-R3.2 WB1-A-R5.1 WB2-A-R3.2 WB2-A-R5.1 WB4-A-R3.2 WB4-A-R5.1 WB6-A-R3.2 WB6-A-R5.1
WB1-A-POS: AMP-1.3(+INA) WB1-A-R2.2 WB1-A-R4.2
WB2-A-NEG: AMP-1.6(-INB) WB2-A-R1.2 WB2-A-R3.1
WB2-A-OUT: AMP-1.7(OUTB)
WB2-A-POS: AMP-1.5(+INB) WB2-A-R2.2 WB2-A-R4.2
WB3-A-NEG: AMP-1.11(-INC) WB3-A-R1.2 WB3-A-R3.1
WB3-A-OUT: AMP-1.10(OUTC) WB3-A-R3.2 WB3-A-R5.1
WB3-A-POS: AMP-1.12(+INC) WB3-A-R2.2 WB3-A-R4.2
WB4-A-NEG: AMP-1.15(-IND) WB4-A-R1.2 WB4-A-R3.1
WB4-A-OUT: AMP-1.16(OUTD)
WB4-A-POS: AMP-1.14(+IND) WB4-A-R2.2 WB4-A-R4.2
WB5-A-NEG: AMP-2.2(-INA) WB5-A-R1.2 WB5-A-R3.1
WB5-A-OUT: AMP-2.1(OUTA) WB5-A-R3.2 WB5-A-R5.1
WB5-A-POS: AMP-2.3(+INA) WB5-A-R2.2 WB5-A-R4.2
WB6-A-NEG: AMP-2.6(-INB) WB6-A-R1.2 WB6-A-R3.1
WB6-A-OUT: AMP-2.7(OUTB)
WB6-A-POS: AMP-2.5(+INB) WB6-A-R2.2 WB6-A-R4.2
WB7-A-NEG: AMP-2.11(-INC) WB7-A-R1.2 WB7-A-R3.1
WB7-A-OUT: AMP-2.10(OUTC) WB7-A-R3.2 WB7-A-R5.1
WB7-A-POS: AMP-2.12(+INC) WB7-A-R2.2 WB7-A-R4.2
WB8-A-NEG: AMP-2.15(-IND) WB8-A-R1.2 WB8-A-R3.1
WB8-A-OUT: AMP-2.16(OUTD) WB8-A-R3.2 WB8-A-R5.1
WB8-A-POS: AMP-2.14(+IND) WB8-A-R2.2 WB8-A-R4.2
WB9-A-NEG: AMP-3.2(-INA) WB9-A-R1.2 WB9-A-R3.1
WB9-A-OUT: AMP-3.1(OUTA) WB9-A-R3.2 WB9-A-R5.1
WB9-A-POS: AMP-3.3(+INA) WB9-A-R2.2 WB9-A-R4.2
WB10-A-NEG: AMP-3.6(-INB) WB10-A-R1.2 WB10-A-R3.1
WB10-A-OUT: AMP-3.7(OUTB) WB10-A-R3.2 WB10-A-R5.1
WB10-A-POS: AMP-3.5(+INB) WB10-A-R2.2 WB10-A-R4.2
WB11-A-NEG: AMP-3.11(-INC) WB11-A-R1.2 WB11-A-R3.1
WB11-A-OUT: AMP-3.10(OUTC) WB11-A-R3.2 WB11-A-R5.1
WB11-A-POS: AMP-3.12(+INC) WB11-A-R2.2 WB11-A-R4.2
WB12-A-NEG: AMP-3.15(-IND) WB12-A-R1.2 WB12-A-R3.1
WB12-A-OUT: AMP-3.16(OUTD) WB12-A-R3.2 WB12-A-R5.1
WB12-A-POS: WB12-A-R2.2 WB12-A-R4.2
WB124-A-POS: AMP-3.14(+IND)
Unconnected: POT-1.3(A0) POT-1.8(A1) POT-1.11(A2) POT-1.17(A3) POT-2.3(A0) POT-2.8(A1) POT-2.11(A2) POT-2.17(A3) POT-3.3(A0) POT-3.8(A1) POT-3.11(A2) POT-3.17(A3)

## Notes on the sheet
- POWER FROM BATTERY
- 3V3 IS BEING USED AS 3V SUPPLY!!! | SD CARD READER
- POWER SUPPLY
- SD CARD LEVEL SHIFTER
- NC
- NC
- NC
- NC
- DIGITAL POTENTIOMETER
- ADC
- NC
- NC
- NC
- NC
- ARDUINO CORE
- GAUGE 1
- DIGITAL POTENTIOMETER
- NC
- NC
- NC
- NC
- CALIBRATION STATUS LEDS
- DIGITAL POTENTIOMETER

## Library data of the parts
3VSUP 5VSUP -3VSUP = v-reg:LM317?*: 500 mA Adjustable Output Positive Voltage Regulator Source: http://www.onsemi.co.jp .. LM317M-D.PDF
3VSUP-BYP 5VSUP-BYP ADC-BYP CRYSTAL-C1 CRYSTAL-C2 LSHIFT1-BYP-1 LSHIFT1-BYP-2 LSHIFT2-BYP-1 LSHIFT2-BYP-2 POT1-BYP POT2-BYP POT3-BYP SD-BYP SHREG-BYP = resistor:C-US: CAPACITOR, American symbol
3VSUP-D1 5VSUP-D1 -3VSUP-D1 = SparkFun-LED:LED-GREEN: Green SMD LED Used in manufacturing of various products at SparkFun Packages: 0603 - SMD 0603 package [Product Link] <http://www.futureelectronics.com/en/technologies/semiconductors/optoelectronics/leds/Pages/9894312-LTST-C190GKT.aspx?CrossPart=HSMG-C190&IM=0> LilyPad 1206 - SMD1206 LilyPad package [Product Link] <http://www.futureelectronics.com/en/Technologies/Product.aspx?ProductID=IN150NGHARVATEKCORPORATION2049943&IM=0> 1206 - SMD1206 package [Product Link] <http://www.futureelectronics.com/en/technologies/semiconductors/optoelectronics/leds/Pages/8315665-LTST-C150KGKT.aspx?IM=0> 1206 Bottom Mount -SMD 1206 Bottom Mount [Product Link] <http://www.digikey.com/product-detail/en/lite-on-inc/LTST-C230KGKT/160-1456-1-ND/386854> SparkFun Products: Pro Mini 328 -5V <https://www.sparkfun.com/products/821> RedBoard <https://www.sparkfun.com/products/12757> MP3 Trigger <https://www.sparkfun.com/products/13720> Makey Makey <https://www.sparkfun.com/products/11076>; PROD_ID: DIO-00862
3VSUP-R1-3VSUP-R3 5VSUP-R1-5VSUP-R3 CAL-1-R1 CAL-1-R2 CAL-2-R1 CAL-2-R2 CAL-3-R1 CAL-3-R2 CAL-4-R1 CAL-4-R2 CAL-5-R1 CAL-5-R2 CAL-6-R1 CAL-6-R2 CAL-7-R1 CAL-7-R2 CAL-8-R1 CAL-8-R2 CAL-9-R1 CAL-9-R2 CAL-10-R1 CAL-10-R2 CAL-11-R1 CAL-11-R2 CAL-12-R1 CAL-12-R2 CAL-13-R1 CAL-13-R2 CAL-14-R1 CAL-14-R2 CAL-15-R1 CAL-15-R2 CAL-16-R1 CAL-16-R2 WB1-R1-WB1-R4 = resistor:R-US_: RESISTOR, American symbol
-3VSUP-BYP AMP1-BYP AMP2-BYP AMP3-BYP ATMEGA328-BYP INPUT-BYP WB1-A-C1 WB2-A-C1 WB3-A-C1 WB4-A-C1 WB5-A-C1 WB6-A-C1 WB7-A-C1 WB8-A-C1 WB9-A-C1 WB10-A-C1 WB11-A-C1 WB12-A-C1 = rcl:C-US: CAPACITOR, American symbol; SPICEPREFIX: C
-3VSUP-R1--3VSUP-R3 POT-WP-R1 RESET-PULLUP WB1-A-R1-WB1-A-R5 WB2-A-R1-WB2-A-R5 WB2-R1-WB2-R4 WB3-A-R1-WB3-A-R5 WB3-R1-WB3-R4 WB4-A-R1-WB4-A-R5 WB4-R1-WB4-R4 WB5-A-R1-WB5-A-R5 WB5-R1-WB5-R4 WB6-A-R1-WB6-A-R5 WB6-R1-WB6-R4 WB7-A-R1-WB7-A-R5 WB7-R1-WB7-R4 WB8-A-R1-WB8-A-R5 WB8-R1-WB8-R4 WB9-A-R1-WB9-A-R5 WB9-R1-WB9-R4 WB10-A-R1-WB10-A-R5 WB10-R1-WB10-R4 WB11-A-R1-WB11-A-R5 WB11-R1-WB11-R4 WB12-A-R1-WB12-A-R5 WB12-R1-WB12-R4 = rcl:R-US_: RESISTOR, American symbol; SPICEPREFIX: R
ADC-1 = MAX11610 10 bit ADC:MAX11610EEE+; MANUFACTURER_PART_NUMBER: MAX11610EEE+; VENDOR: Maxim Integrated Products
AMP-1-AMP-3 = LTC6082 Strain Gauge Amplifier:LTC6082HGNPBF; MANUFACTURER_PART_NUMBER: LTC6082HGN#PBF; VENDOR: Linear Technology
ATMEGA328 = SparkFun-IC-Microcontroller:ATMEGA328P_TQFP: Popular 328P in QFP Storefront component: ATmega328 - TQFP <https://www.sparkfun.com/products/13448> (COM-13448) Datasheet <http://www.sparkfun.com/datasheets/Components/SMD/ATMega328.pdf> SparkFun Products SparkFun RedBoard - Programmed with Arduino <https://www.sparkfun.com/products/12757> (DEV-12757) Arduino Pro Mini 328 - 5V/16MHz <https://www.sparkfun.com/products/11113> (DEV-11113) Arduino Pro Mini 328 - 3.3V/8MHz <https://www.sparkfun.com/products/11114> (DEV-11114) SparkFun OpenLog <https://www.sparkfun.com/products/13712> (DEV-13712) SparkFun MicroView - OLED Arduino Module <https://www.sparkfun.com/products/12923> (DEV-12923) SparkFun Digital Sandbox <https://www.sparkfun.com/products/12651> (DEV-12651) SparkFun PicoBoard <https://www.sparkfun.com/products/11888> (WIG-11888) Arduino Fio <https://www.sparkfun.com/products/10116> (DEV-10116) LilyPad Arduino 328 Main Board <https://www.sparkfun.com/products/13342> (DEV-13342) SparkFun RedStick <https://www.sparkfun.com/products/13741> (DEV-13741) LilyPad MP3 <https://www.sparkfun.com/products/11013> (DEV-11013) LilyPad Arduino SimpleSnap <https://www.sparkfun.com/products/10941> (DEV-10941) SparkFun Stepoko <https://www.sparkfun.com/products/13899> (ROB-13899) SparkFun Geiger Counter <https://www.sparkfun.com/products/11345> (SEN-11345) SparkFun EL Sequencer <https://www.sparkfun.com/products/12781> (COM-12781) Arduino Pro 328 - 5V/16MHz <https://www.sparkfun.com/products/10915> (DEV-10915) CryptoCape <https://www.sparkfun.com/products/12773> (DEV-12773) SparkFun IR Thermometer Evaluation Board - MLX90614 <https://www.sparkfun.com/products/10740> (SEN-10740) SparkFun RedBot Mainboard <https://www.sparkfun.com/products/12097> (ROB-12097) Arduino Pro 328 - 3.3V/8MHz <https://www.sparkfun.com/products/10914> (DEV-10914) SparkFun Block for Intel® Edison - Arduino <https://www.sparkfun.com/products/13036> (DEV-13036) SparkFun Simon Says - Surface Mount Soldering Kit <https://www.sparkfun.com/products/10935> (KIT-10935) SparkFun 7-Segment Serial Display - Red <https://www.sparkfun.com/products/11441> (COM-11441) SparkFun 7-Segment Serial Display - White <https://www.sparkfun.com/products/11629> (COM-11629) SparkFun 7-Segment Serial Display - Yellow <https://www.sparkfun.com/products/11443> (COM-11443) SparkFun 7-Segment Serial Display - Kelly Green <https://www.sparkfun.com/products/11440> (COM-11440) SparkFun 7-Segment Serial Display - Blue <https://www.sparkfun.com/products/11442> (COM-11442) SparkFun OpenSegment Serial Display - 20mm (Blue) <https://www.sparkfun.com/products/11647> (COM-11647) SparkFun OpenSegment Serial Display - 20mm (Green) <https://www.sparkfun.com/products/11646> (COM-11646) SparkFun OpenSegment Serial Display - 20mm (White) <https://www.sparkfun.com/products/11648> (COM-11648) SparkFun OpenSegment Serial Display - 20mm (Red) <https://www.sparkfun.com/products/11644> (COM-11644) SparkFun OpenSegment Serial Display - 20mm (Yellow) <https://www.sparkfun.com/products/11645> (COM-11645) SparkFun OpenSegment Shield <https://www.sparkfun.com/products/13190> (DEV-13190); PROD_ID: IC-09069; VALUE: ATMEGA328P_TQFP
CAL-1-CAL-16 = SparkFun-LED:LED-RG: LiteOn Technology Corporation LTST-C195KGJRKT - LED GREEN/RED CLEAR 0606 SMD Color: Red/Green Lens Transparency: Clear Lens Style/Size: Rectangle with Flat top, 1.10 x 1.5 mm mC Rating45mcd Red, 35 mcd Green Current: 20mA Red, 20mA Green Forward Voltage: 2V Red, 2V Green Packages: 0606 SparkFun Products: Electric Imp imp002 Breakout <[https://www.sparkfun.com/products/12958]>; PROD_ID: DIO-12140
CRYSTAL = special:XTAL/S: CRYSTAL
ICSP = SparkFun-Connectors:CONN_03X2: Multi connection point. Often used as Generic Header-pin footprint for 0.1 inch spaced/style header connections You can populate with any combo of single row headers, but if you'd like an exact match, check these: Header - 2x3 (Male, 0.1") <https://www.sparkfun.com/products/12807> (PRT-12807) Header - 2x3 (Female, 0.1") <https://www.sparkfun.com/products/13010> (PRT-13010) 2x3 Pin Shrouded Header <https://www.sparkfun.com/products/10877> (PRT-10877) On any of the 0.1 inch spaced packages, you can populate with these: Break Away Headers - Straight <https://www.sparkfun.com/products/116> (PRT-00116) Break Away Male Headers - Right Angle <https://www.sparkfun.com/products/553> (PRT-00553) Female Headers <https://www.sparkfun.com/products/115> (PRT-00115) Break Away Headers - Machine Pin <https://www.sparkfun.com/products/117> (PRT-00117) Break Away Female Headers - Swiss Machine Pin <https://www.sparkfun.com/products/743> (PRT-00743) Special note: the shrouded connector mates well with our 3x2 ribbon cables: Ribbon Crimp Connector - 6-pin (2x3, Female) <https://www.sparkfun.com/products/10651> (PRT-10651) Ribbon Cable - 6 wire (15ft) <https://www.sparkfun.com/products/10646> (PRT-10646); PROD_ID: CONN-11566; VALUE: FEMALE 2x3
LSHIFT-1 LSHIFT-2 = SparkFun-IC-Comms:TXB0104PWR: 4-Bit Bi-Directional Level Shifter 1.2V-3.6V (VCCA) to 1.65V-5.5V (VCCB) bi-directional level shifter with auto direction sensing. Max data rate - VCCA 1.8V: 20Mbps (50ns), VCCA 3.3V: 100Mbps (10ns) Digikey: 296-21929-1-ND (TSSOP) Datasheet <http://cdn.sparkfun.com/datasheets/BreakoutBoards/txb0104.pdf> SparkFun Products SparkFun Cellular Shield - MG2639 <https://www.sparkfun.com/products/13120> (CEL-13120) SparkFun Level Shifting microSD Breakout <https://www.sparkfun.com/products/13743> (DEV-13743) SparkFun Voltage-Level Translator Breakout - TXB0104 <https://www.sparkfun.com/products/11771> (BOB-11771) SparkFun Block for Intel® Edison - UART <https://www.sparkfun.com/products/13040> (DEV-13040) SparkFun Block for Intel® Edison - Arduino <https://www.sparkfun.com/products/13036> (DEV-13036); PROD_ID: IC-11329
POT-1-POT-3 = AD5254 4x1k Digital Potentiometer:AD5254BRUZ1; MANUFACTURER_PART_NUMBER: AD5254BRUZ1; VENDOR: Analog Devices Inc
SD-SOCKET = SparkFun-Connectors:SD_CARD_SOCKET: SD Memory Card Connector (standard "large" size) Push-push normal type, CD enable, WP enable. Here is the connector we sell at SparkFun: SD/MMC Socket <https://www.sparkfun.com/products/12769> (PRT-12769) Datasheet <https://cdn.sparkfun.com/datasheets/Prototyping/19608.pdf> It is used on these SparkFun products: SparkFun SD/MMC Card Breakout <https://www.sparkfun.com/products/12941> (BOB-12941) SD Sniffer <https://www.sparkfun.com/products/11468> (TOL-11468); PROD_ID: CONN-11976; SF_ID: PRT-12769
SHREG = 74xx-eu:74*674: 16-bit SHIFT REGISTER parallel to serial conversion
X1 X3-X5 = con-phoenix-254:MPT6: PHOENIX CONNECTOR; OC_FARNELL: unknown; OC_NEWARK: unknown
X2 = con-phoenix-254:MPT2: PHOENIX CONNECTOR; OC_FARNELL: unknown; OC_NEWARK: unknown